# Altium schematic sheet Main-Flight-Computer-Card.SchDoc
size A2 portrait; Organization: Altium Limited; Address1: L3, 12a Rodborough Rd; Address2: Frenchs Forest; Address3: NSW; Address4: Australia 2086
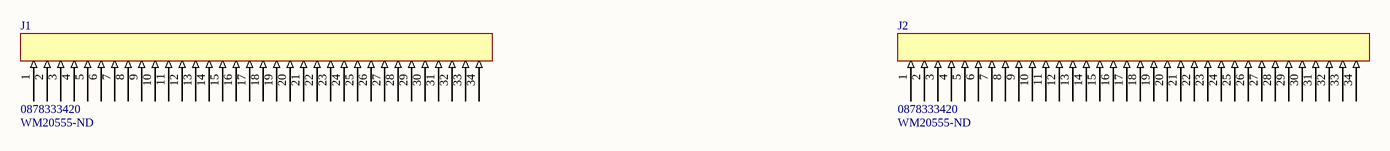
[diagram p0: Main-Flight-Computer-Card.SchDoc]

## Parts
J1  0878333420  Supplier Part Number 1: WM20555-ND  [0878333420]
J2  0878333420  Supplier Part Number 1: WM20555-ND  [0878333420]

## Nets

Not connected (* = marked no-connect by the designer): J1 1 2 3 4 5 6 7 8 9 10 11 12 13 14 15 16 17 18 19 20 21 22 23 24 25 26 27 28 29 30 31 32 33 34; J2 1 2 3 4 5 6 7 8 9 10 11 12 13 14 15 16 17 18 19 20 21 22 23 24 25 26 27 28 29 30 31 32 33 34

## Notes on the sheet
- Title
- Size:
- Date:
- File:
- A2
- Number:
- Time:
- Revision:
- Sheet
- of

## Library data of the parts
J1 J2 = 0878333420: Supplier 1: Digi-Key